# EAGLE schematic wifi (EAGLE 5.11)
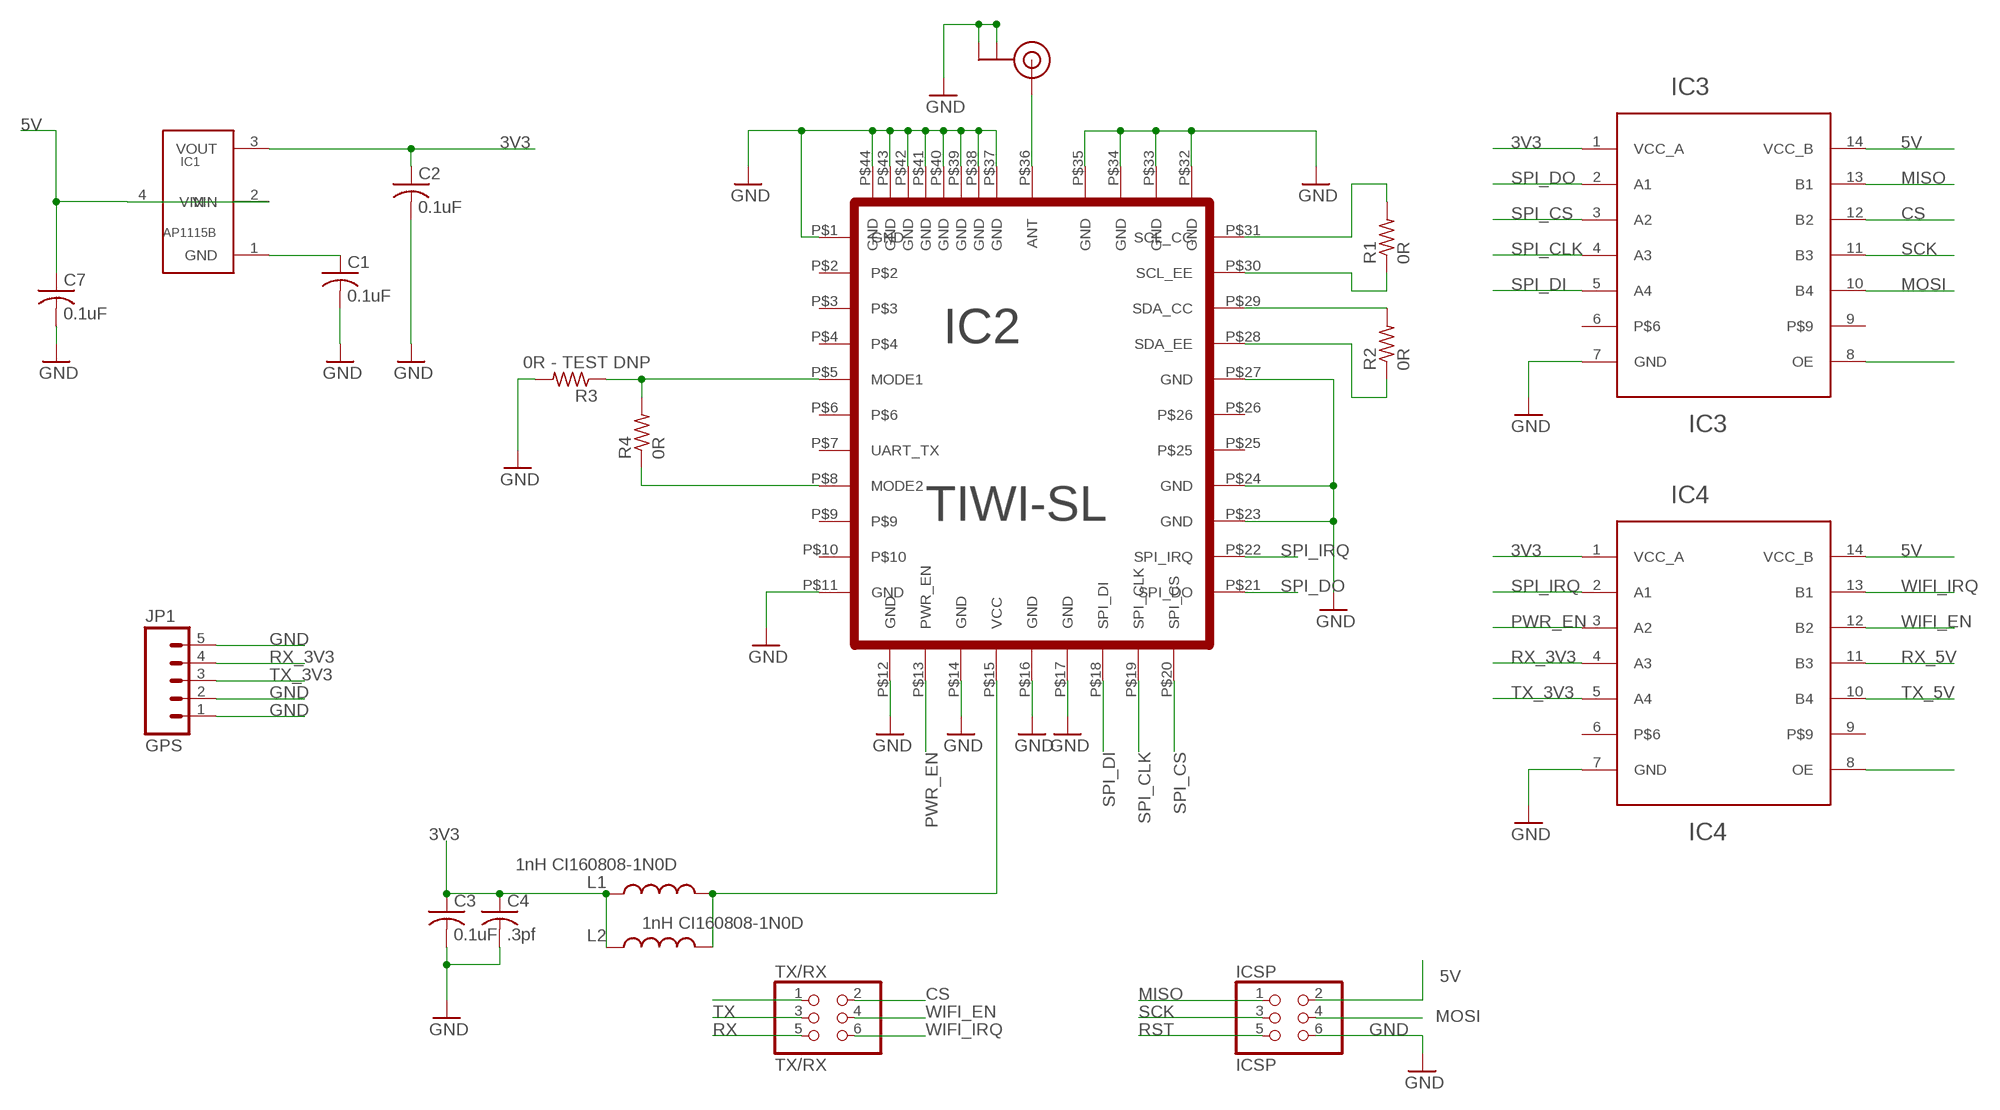
[diagram p0: schematic, sheet 1]

## Parts
ANT  U.FL  [U.FL]
C1  0.1uF  C-USC0603  [C0603]
C2  0.1uF  C-USC0603  [C0603]
C3  0.1uF  C-USC0603  [C0603]
C4  .3pf  C-USC0603  [C0603]
C7  0.1uF  C-USC0603  [C0603]
IC1  AP1115B  AP1115  [SOT89-3L]
IC2  TIWI-SL  [TIWI-SL]
IC3  TXS0104EPWR  TXS0104E  [TSSOP-14]
IC4  TXS0104EPWR  TXS0104E  [TSSOP-14]
ICSP  ICSP  PINHD-2X3  [2X03]
JP1  GPS  M05PTH  [1X05]
L1  1nH CI160808-1N0D  INDUCTOR0603  [0603]
L2  1nH CI160808-1N0D  INDUCTOR0603  [0603]
R1  0R  R-US_R0603  [R0603]
R2  0R  R-US_R0603  [R0603]
R3  0R - TEST DNP  R-US_R0603  [R0603]
R4  0R  R-US_R0603  [R0603]
TX/RX  TX/RX  PINHD-2X3  [2X03]

## Nets
3V3 [power]: C2.1 C3.1 C4.1 IC1.3(VOUT) IC3.1(VCC_A) IC4.1(VCC_A) L1.1 L2.1
5V [power]: C7.1 IC1.2(VIN) IC1.4(VIN) IC3.14(VCC_B) IC4.14(VCC_B) ICSP.2
CS: IC3.12(B2) TX/RX.2
GND: ANT.P$1(GND) ANT.P$2(GND) C1.2 C2.2 C3.2 C4.2 C7.2 IC2.P$1(GND) IC2.P$11(GND) IC2.P$12(GND) IC2.P$14(GND) IC2.P$16(GND) IC2.P$17(GND) IC2.P$23(GND) IC2.P$24(GND) IC2.P$27(GND) IC2.P$32(GND) IC2.P$33(GND) IC2.P$34(GND) IC2.P$35(GND) IC2.P$37(GND) IC2.P$38(GND) IC2.P$39(GND) IC2.P$40(GND) IC2.P$41(GND) IC2.P$42(GND) IC2.P$43(GND) IC2.P$44(GND) IC3.7(GND) IC4.7(GND) ICSP.6 JP1.1 JP1.2 JP1.5 R3.2
MISO: IC3.13(B1) ICSP.1
MOSI: IC3.10(B4) ICSP.4
N$1: TX/RX.1
N$2: C1.1 IC1.1(GND)
N$3: ANT.P$3(SIGNAL) IC2.P$36(ANT)
N$96: IC2.P$5(MODE1) R3.1 R4.2
N$97: IC2.P$8(MODE2) R4.1
N$98: IC2.P$31(SCL_CC) R1.2
N$99: IC2.P$30(SCL_EE) R1.1
N$100: IC2.P$29(SDA_CC) R2.2
N$101: IC2.P$28(SDA_EE) R2.1
N$102: IC2.P$15(VCC) L1.2 L2.2
N$117: IC3.8(OE)
N$126: IC4.8(OE)
PWR_EN: IC2.P$13(PWR_EN) IC4.3(A2)
RST: ICSP.5
RX: TX/RX.5
RX_3V3: IC4.4(A3) JP1.4
RX_5V: IC4.11(B3)
SCK: IC3.11(B3) ICSP.3
SPI_CLK: IC2.P$19(SPI_CLK) IC3.4(A3)
SPI_CS: IC2.P$20(SPI_CS) IC3.3(A2)
SPI_DI: IC2.P$18(SPI_DI) IC3.5(A4)
SPI_DO: IC2.P$21(SPI_DO) IC3.2(A1)
SPI_IRQ: IC2.P$22(SPI_IRQ) IC4.2(A1)
TX: TX/RX.3
TX_3V3: IC4.5(A4) JP1.3
TX_5V: IC4.10(B4)
WIFI_EN: IC4.12(B2) TX/RX.4
WIFI_IRQ: IC4.13(B1) TX/RX.6
Unconnected: IC2.P$2 IC2.P$3 IC2.P$4 IC2.P$6 IC2.P$7(UART_TX) IC2.P$9 IC2.P$10 IC2.P$25 IC2.P$26 IC3.6 IC3.9 IC4.6 IC4.9

## Library data of the parts
ANT = SparkFun:U.FL
C1-C4 C7 = rcl:C-US: CAPACITOR, American symbol
IC1 = wifi:AP1115
IC2 = pcbqr_v3:TIWI-SL
IC3 IC4 = pcbqr_v3:TXS0104E
ICSP TX/RX = pinhead:PINHD-2X3: PIN HEADER
JP1 = SparkFun:M05: Header 5 Standard 5-pin 0.1" header. Use with straight break away headers (SKU : PRT-00116), right angle break away headers (PRT-00553), swiss pins (PRT-00743), machine pins (PRT-00117), and female headers (PRT-00115). Molex polarized connector foot print use with SKU : PRT-08230 with associated crimp pins and housings.
L1 L2 = SparkFun:INDUCTOR: Inductors Basic Inductor/Choke - 0603 and 1206. Footprints are not proven and vary greatly between part numbers.
R1-R4 = pcbqr_v3:R-US_: RESISTOR, American symbol

## Net classes
0 default: width 0.203 mm, drill 0.356 mm, clearance 0.203 mm
1 power: width 0.203 mm